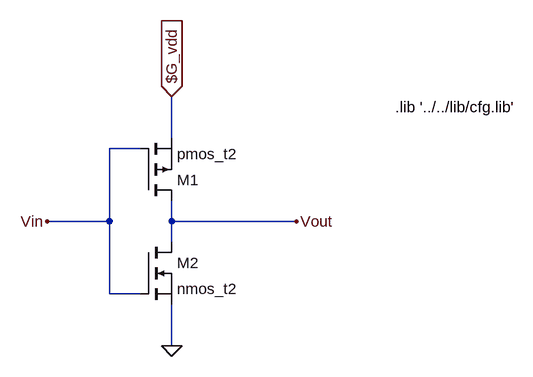
[diagram p0: schematic inverter.asc]
inverter.asc, the LTspice schematic file:
Version 4
SHEET 1 880 680
WIRE 160 48 160 -16
WIRE 112 64 64 64
WIRE 64 176 64 64
WIRE 64 176 -32 176
WIRE 160 176 160 144
WIRE 352 176 160 176
WIRE 160 208 160 176
WIRE 64 288 64 176
WIRE 112 288 64 288
WIRE 160 368 160 304
FLAG 352 176 Vout
FLAG 160 368 0
FLAG 160 -16 $G_vdd
IOPIN 160 -16 In
FLAG -32 176 Vin
SYMBOL pmos 112 144 M180
SYMATTR InstName M1
SYMATTR Value pmos_t2
SYMATTR Prefix X
SYMBOL nmos 112 208 R0
SYMATTR InstName M2
SYMATTR Value nmos_t2
SYMATTR Prefix X
TEXT 504 0 Left 2 !.lib '../../lib/cfg.lib'

The netlist it stands for:
* inverter.asc
XM1 Vout Vin $G_vdd pmos_t2  ; pins D G S
XM2 Vout Vin 0 nmos_t2  ; pins D G S
.lib '../../lib/cfg.lib'
.backanno
.end